# EAGLE design Nixie Test 3757 (EAGLE 6.5.0)
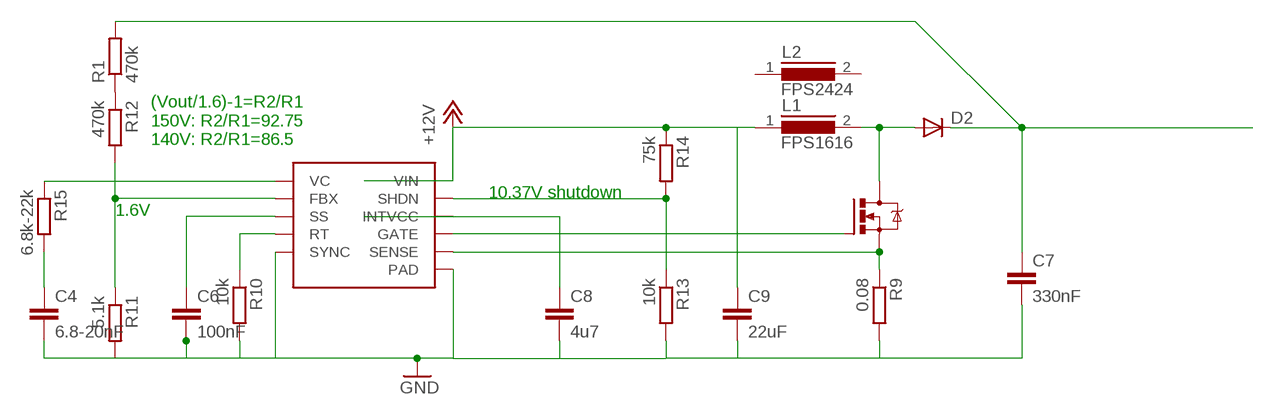
[diagram p0: schematic, sheet 1]

## Parts
C4  6.8-20nF  C-EUC0805K  [C0805K]
C6  100nF  C-EUC0805K  [C0805K]
C7  330nF  C-EUC1812  [C1812]
C8  4u7  C-EUC1206K  [C1206K]
C9  22uF  C-EUC1210K  [C1210K]
D2  DIODE-DO219AB  [DO219AB]
L1  FPS1616  [1616FPS_22UH]
L2  FPS2424  [242408FPS_22UH]
Q1  N-MOSFET-TO252-DPAK  [TO252]
R1  470k  R-EU_R0805  [R0805]
R9  0.08  R-EU_R0805  [R0805]
R10  10k  R-EU_R0805  [R0805]
R11  5.1k  R-EU_R0805  [R0805]
R12  470k  R-EU_R0805  [R0805]
R13  10k  R-EU_R0805  [R0805]
R14  75k  R-EU_R0805  [R0805]
R15  6.8k-22k  R-EU_R0805  [R0805]
U2  LT3757MSOP-10  [MSOP-10]

## Nets
+12V: C9.1 L1.1 R14.1 U2.10(VIN)
GND: C4.2 C6.2 C7.2 C8.2 C9.2 R9.2 R10.2 R11.2 R13.2 U2.5(SYNC) U2.PAD
N$1: R1.1 R12.1
N$19: Q1.1(G) U2.7(GATE)
N$20: R11.1 R12.2 U2.2(FBX)
N$21: D2.A L1.2 Q1.3(D)
N$22: C7.1 D2.C R1.2
N$23: C6.1 U2.3(SS)
N$24: R10.1 U2.4(RT)
N$25: Q1.2(S) R9.1 U2.6(SENSE)
N$26: R13.1 R14.2 U2.9(SHDN)
N$27: C4.1 R15.2
N$28: R15.1 U2.1(VC)
N$29: C8.1 U2.8(INTVCC)
Unconnected: L2.1 L2.2

## Notes on the sheet
- (Vout/1.6)-1=R2/R1
  150V: R2/R1=92.75
  140V: R2/R1=86.5
- 10.37V shutdown
- 1.6V

## Library data of the parts
C4 C6-C9 = rcl:C-EU: CAPACITOR, European symbol
D2 = diode_extended:DIODE-: DIODE
L1 L2 = inductor_power:FPS: High Power Density, High Efficiency, Shielded Inductors Source: coiltronics_dr_series.pdf
Q1 = N-MOSFET:N-MOSFET
R1 R9-R15 = rcl:R-EU_: RESISTOR, European symbol
U2 = LT3757:LT3757

## Board
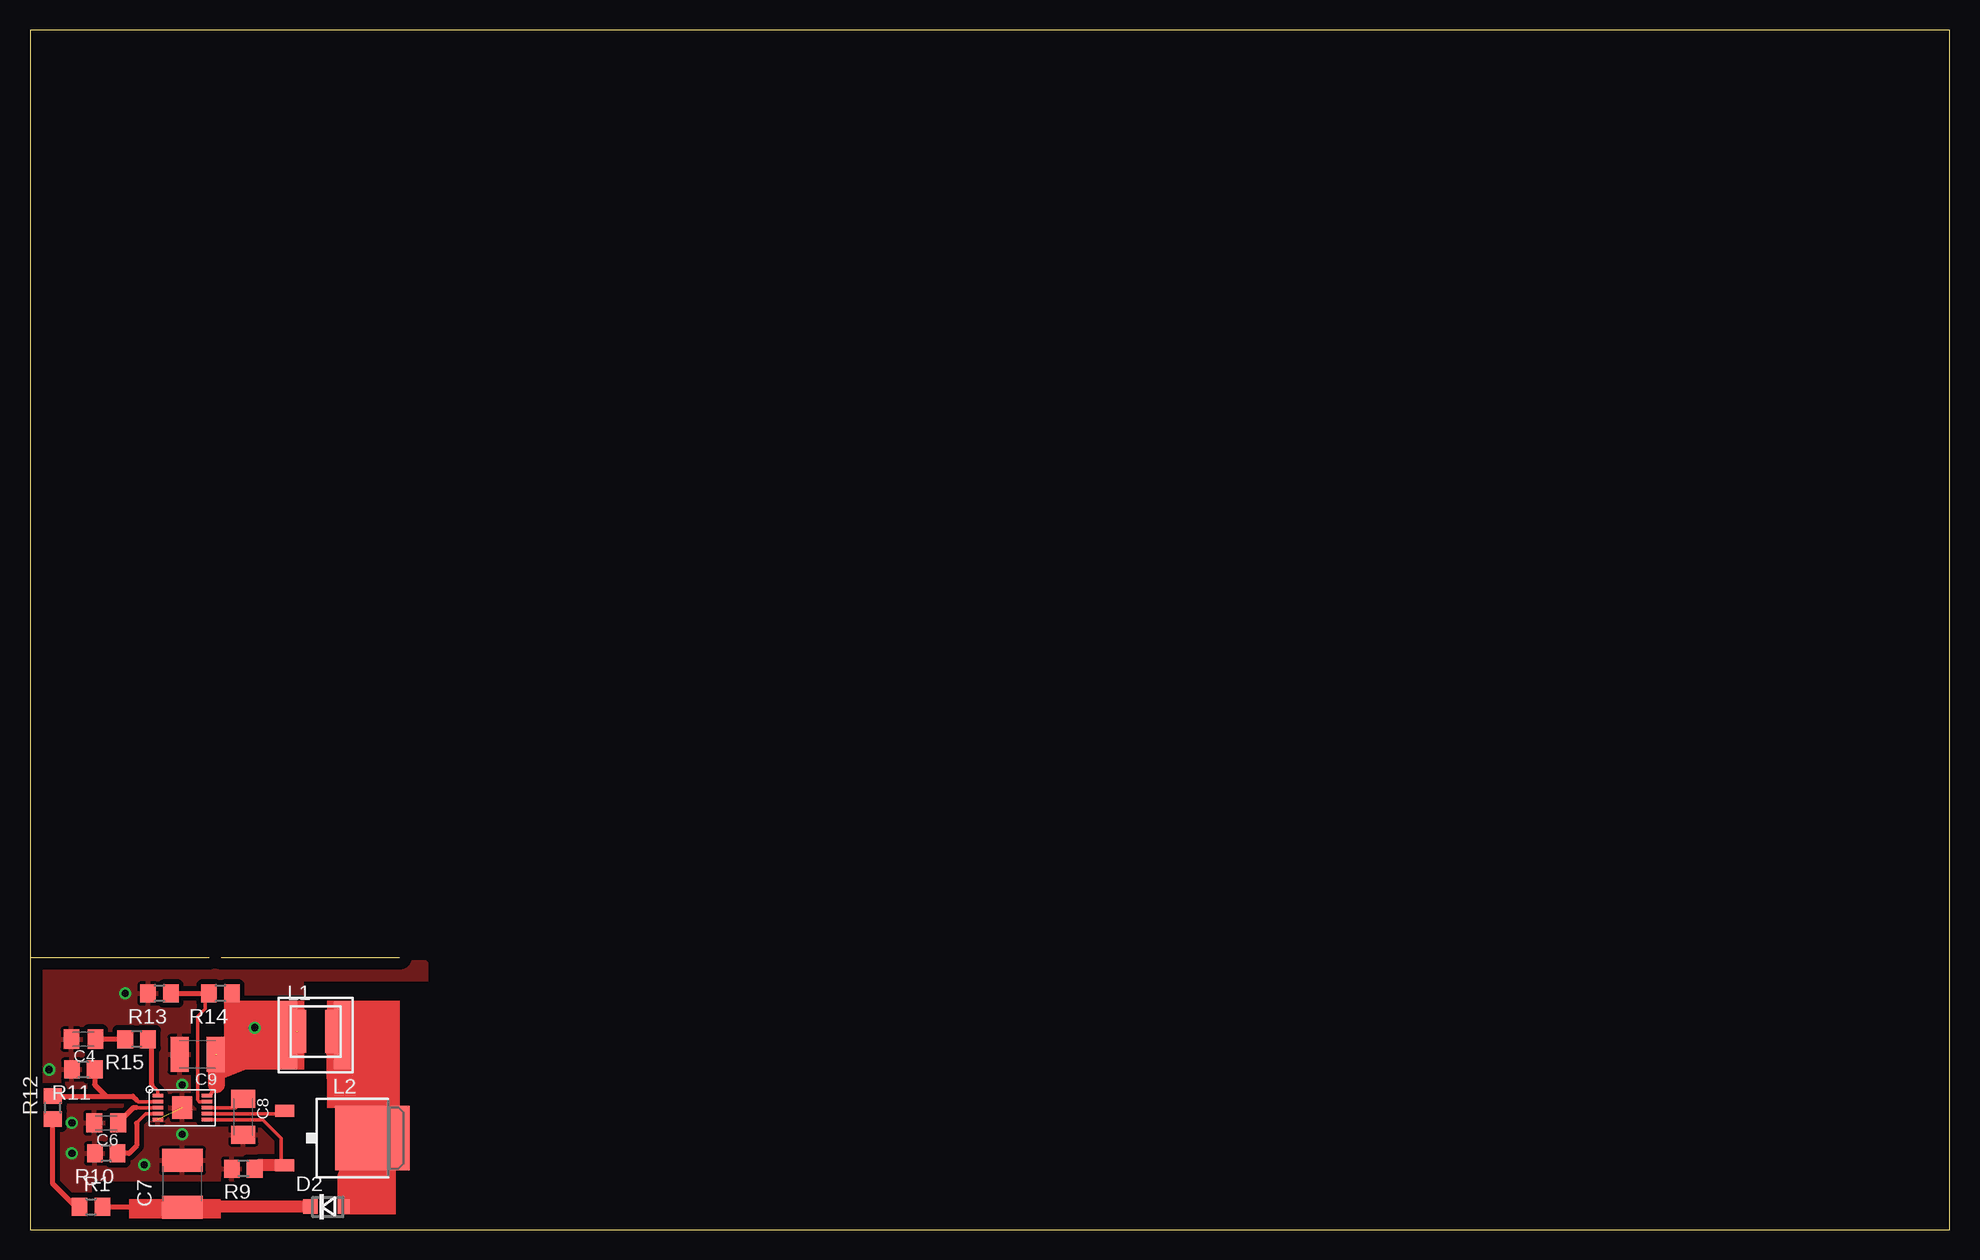
[diagram p1: board, top side]

Size 160 x 100 mm. Coordinates in mm from the lower left corner, seen from the top.
Outline: 0.06,22.67 14.92,22.67
Outline: 15.94,22.67 30.8,22.67
Outline: 0,0 160,0 160,100 0,100 0,0
Copper layers (1*16): Top 0.035mm / dielectric 1.5mm / Bottom 0.035mm
Design rules "default *": minimum track width 10mil, minimum drill 24mil, track to track 16mil, track to pad 8mil, pad to pad 8mil, via to via 8mil, smd to smd 8mil, copper to edge 40mil, drill to drill 8mil, minimum pad ring 10mil, minimum via ring 8mil, stop-mask expansion 4mil, vias tented up to drill 0mil, thermal gap 10mil
tRestrict: area 5.4,-0.3 to 32.7,12.4; area 22.9,12.1 to 33,20.6

### Footprints (pad centres in the part's own frame; a part is rotated, then mirrored left to right if it is on the bottom)
C0805K = smd 1.3 x 1.6: 1 -1,0; 2 1,0
C1812 = smd 1.9 x 3.4: 1 -1.95,0; 2 1.95,0
C1206K = smd 1.5 x 2: 1 -1.5,0; 2 1.5,0
C1210K = smd 1.5 x 2.9: 1 -1.5,0; 2 1.5,0
DO219AB = smd 1 x 1.2: A 1.4,0 | smd 1.2 x 1.2: C -1.4,0
1616FPS_22UH = smd 1.5 x 3.6: 1 -1.525,0; 2 1.525,0
242408FPS_22UH = smd 1.6 x 5.7: 1 -2.35,0; 2 2.35,0
TO252 = smd 1 x 1.6: 1 -2.28,-4.8; 2 2.28,-4.8 | smd 5.4 x 6.2: 3 0,2.5
R0805 = smd 1.3 x 1.5: 1 -0.95,0; 2 0.95,0
MSOP-10 = smd 0.305 x 0.889: 1 -1,-2.045; 2 -0.5,-2.045; 3 0,-2.045; 4 0.5,-2.045; 5 1,-2.045; 6 1,2.045; 7 0.5,2.045; 8 0,2.045; 9 -0.5,2.045; 10 -1,2.045 | smd 1.88 x 1.68: PAD 0,0

### Placement (x,y rotation side)
C4  4.45,15.88 180 top
C6  6.35,8.89 180 top
C7  12.7,3.81 90 top
C8  17.78,9.4 270 top
C9  13.97,14.61 180 top
D2  24.77,1.91 0 top
L1  23.81,16.51 0 top
L2  23.81,16.19 180 top
Q1  26.04,7.62 270 top
R1  5.08,1.91 0 top
R9  17.78,5.08 180 top
R10  6.35,6.35 180 top
R11  4.45,13.34 180 top
R12  1.91,10.16 90 top
R13  10.79,19.68 180 top
R14  15.88,19.68 180 top
R15  8.89,15.88 180 top
U2  12.7,10.16 270 top

### Tracks (layer width: path | path; a pad name or v marks a point on that pad's centre or on a via)
+12V  (2 unrouted)
  Top 0.305: U2.10 14.97,11.16 15.56,12.06
  Top 0.406: R14.1 16.84,16.83 15.71,13.2
  Top 1.422: 15.56,12.06 15.56,14.61 15.71,13.2 18.41,14.29 20,16.51 22.23,16.51
GND  (via drill 0.6)  (1 unrouted)
  other vias: 3.49,6.35 3.49,8.89 1.59,13.34 7.94,19.68 12.7,7.94 12.7,12.06 9.53,5.4
  pour Top: 0,0 33.02,0 33.02,22.23 0,22.23
N$1
  Top 0.406: R1.1 3.81,1.91 1.91,3.81 R12.1
N$8  (via drill 0.6)
  other vias: 18.73,16.83
N$19
  Top 0.305: U2.7 21,9.66 Q1.1
N$20
  Top 0.305: U2.2 9.03,10.66 8.89,10.79
  Top 0.406: R12.2 6.35,11.11 | 6.35,11.11 8.57,11.11 8.89,10.79 | R11.1 5.39,12.06 6.35,11.11
N$21
  Top 0.406: Q1.3 28.54,6.95
  Top 1.016: D2.A 26.16,4.58 28.54,6.95
  Top 1.422: L1.2 25.4,12.7 28.57,9.53 28.57,7.66 Q1.3
N$22
  Top 0.406: R1.2 6.08,1.86 C7.1 12.74,1.91
  Top 1.016: D2.C 12.74,1.91
N$23
  Top 0.305: U2.3 8.89,10.16
  Top 0.406: 8.89,10.16 8.62,10.16 C6.1
N$24
  Top 0.305: U2.4 9.66,9.66 8.89,8.89
  Top 0.406: 8.89,8.89 8.89,6.99 8.26,6.35 R10.1
N$25
  Top 0.305: U2.6 19.41,9.16 20.95,7.62 20.95,5.62 Q1.2
  Top 1.016: Q1.2 18.99,5.34 R9.1
N$26
  Top 0.305: U2.9 14.11,10.66 13.97,10.79 13.97,17.78 14.61,18.41 14.61,19.36 R14.2
  Top 0.406: R13.1 R14.2
N$27
  Top 0.406: R15.2 C4.1
N$28
  Top 0.305: U2.1 10.65,11.57 10.16,12.06
  Top 0.406: 10.16,12.06 10.16,15.55 R15.1
N$29
  Top 0.305: U2.8 17.14,10.16 17.78,10.79 18.18,10.79 C8.1
(copper drawn outside any net)
  shapes: Top area x4